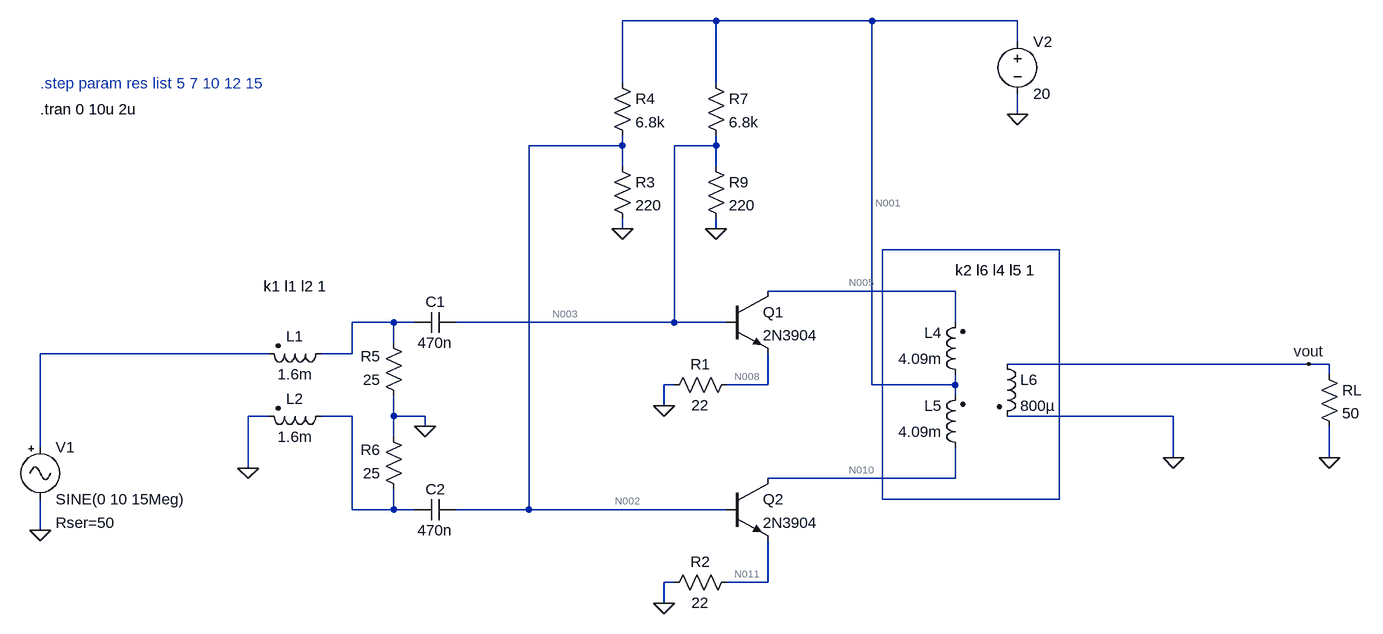
[diagram p0: schematic 0.5W QRP Amplifier class B from Video.asc]
0.5W QRP Amplifier class B from Video.asc, the LTspice schematic file:
Version 4
SHEET 1 1144 680
WIRE 144 -400 0 -400
WIRE 384 -400 144 -400
WIRE 608 -400 384 -400
WIRE 608 -368 608 -400
WIRE 0 -304 0 -400
WIRE 144 -304 144 -400
WIRE 608 -256 608 -288
WIRE 0 -208 0 -224
WIRE 0 -208 -144 -208
WIRE 144 -208 144 -224
WIRE 144 -208 80 -208
WIRE 0 -176 0 -208
WIRE 144 -176 144 -208
WIRE 0 -80 0 -96
WIRE 144 -80 144 -96
WIRE 672 -48 400 -48
WIRE 512 16 224 16
WIRE -352 64 -416 64
WIRE -320 64 -352 64
WIRE 80 64 80 -208
WIRE 80 64 -256 64
WIRE 160 64 80 64
WIRE 512 64 512 16
WIRE -352 96 -352 64
WIRE -544 112 -896 112
WIRE -416 112 -416 64
WIRE -416 112 -464 112
WIRE 1056 128 592 128
WIRE 1088 128 1056 128
WIRE 1088 144 1088 128
WIRE 80 160 64 160
WIRE 224 160 224 112
WIRE 224 160 160 160
WIRE 384 160 384 -400
WIRE 512 160 512 144
WIRE 512 160 384 160
WIRE 512 176 512 160
WIRE 64 192 64 160
WIRE -544 208 -576 208
WIRE -416 208 -464 208
WIRE -352 208 -352 176
WIRE -304 208 -352 208
WIRE 848 208 592 208
WIRE -304 224 -304 208
WIRE -352 240 -352 208
WIRE -896 256 -896 112
WIRE 848 272 848 208
WIRE 1088 272 1088 224
WIRE -576 288 -576 208
WIRE 512 304 512 256
WIRE 512 304 224 304
WIRE 400 336 400 -48
WIRE 672 336 672 -48
WIRE 672 336 400 336
WIRE -416 352 -416 208
WIRE -352 352 -352 320
WIRE -352 352 -416 352
WIRE -320 352 -352 352
WIRE -144 352 -144 -208
WIRE -144 352 -256 352
WIRE 160 352 -144 352
WIRE -896 384 -896 336
WIRE 80 464 64 464
WIRE 224 464 224 400
WIRE 224 464 160 464
WIRE 64 496 64 464
FLAG 64 192 0
FLAG 64 496 0
FLAG -896 384 0
FLAG 0 -80 0
FLAG 848 272 0
FLAG 1088 272 0
FLAG 608 -256 0
FLAG -576 288 0
FLAG -304 224 0
FLAG 144 -80 0
FLAG 1056 128 vout
SYMBOL npn 160 16 R0
SYMATTR InstName Q1
SYMATTR Value 2N3904
SYMBOL npn 160 304 R0
SYMATTR InstName Q2
SYMATTR Value 2N3904
SYMBOL res 176 144 R90
WINDOW 0 0 56 VBottom 2
WINDOW 3 32 56 VTop 2
SYMATTR InstName R1
SYMATTR Value 22
SYMBOL res 176 448 R90
WINDOW 0 0 56 VBottom 2
WINDOW 3 32 56 VTop 2
SYMATTR InstName R2
SYMATTR Value 22
SYMBOL Misc\\signal -896 240 R0
WINDOW 123 0 0 Left 0
WINDOW 39 24 132 Left 2
SYMATTR SpiceLine Rser=50
SYMATTR InstName V1
SYMATTR Value SINE(0 10 15Meg)
SYMBOL res -16 -192 R0
SYMATTR InstName R3
SYMATTR Value 220
SYMBOL res -16 -320 R0
SYMATTR InstName R4
SYMATTR Value 6.8k
SYMBOL ind2 528 160 R180
WINDOW 0 36 80 Left 2
WINDOW 3 36 40 Left 2
SYMATTR InstName L4
SYMATTR Value 4.09m
SYMATTR Type ind
SYMBOL ind2 528 272 R180
WINDOW 0 36 80 Left 2
WINDOW 3 36 40 Left 2
SYMATTR InstName L5
SYMATTR Value 4.09m
SYMATTR Type ind
SYMBOL ind2 576 112 R0
SYMATTR InstName L6
SYMATTR Value 800µ
SYMATTR Type ind
SYMBOL res 1072 128 R0
SYMATTR InstName RL
SYMATTR Value 50
SYMBOL voltage 608 -384 R0
WINDOW 123 0 0 Left 0
WINDOW 39 0 0 Left 0
SYMATTR InstName V2
SYMATTR Value 20
SYMBOL ind2 -448 96 R90
WINDOW 0 5 56 VBottom 2
WINDOW 3 32 56 VTop 2
SYMATTR InstName L1
SYMATTR Value 1.6m
SYMATTR Type ind
SYMBOL ind2 -448 192 R90
WINDOW 0 5 56 VBottom 2
WINDOW 3 32 56 VTop 2
SYMATTR InstName L2
SYMATTR Value 1.6m
SYMATTR Type ind
SYMBOL cap -256 48 R90
WINDOW 0 0 32 VBottom 2
WINDOW 3 32 32 VTop 2
SYMATTR InstName C1
SYMATTR Value 470n
SYMBOL cap -256 336 R90
WINDOW 0 0 32 VBottom 2
WINDOW 3 32 32 VTop 2
SYMATTR InstName C2
SYMATTR Value 470n
SYMBOL res -336 192 R180
WINDOW 0 36 76 Left 2
WINDOW 3 36 40 Left 2
SYMATTR InstName R5
SYMATTR Value 25
SYMBOL res -336 336 R180
WINDOW 0 36 76 Left 2
WINDOW 3 36 40 Left 2
SYMATTR InstName R6
SYMATTR Value 25
SYMBOL res 128 -320 R0
SYMATTR InstName R7
SYMATTR Value 6.8k
SYMBOL res 128 -192 R0
SYMATTR InstName R9
SYMATTR Value 220
TEXT 512 -16 Left 2 !k2 l6 l4 l5 1
TEXT -896 -264 Left 2 !.tran 0 10u 2u
TEXT -896 -304 Left 2 ;.step param res list 5 7 10 12 15
TEXT -552 8 Left 2 !k1 l1 l2 1

The netlist it stands for:
* 0.5W QRP Amplifier class B from Video.asc
Q1 N005 N003 N008 0 2N3904
Q2 N010 N002 N011 0 2N3904
R1 N008 0 22
R2 N011 0 22
V1 N007 0 SINE(0 10 15Meg) Rser=50
R3 N002 0 220
R4 N001 N002 6.8k
L4 N001 N005 4.09m
L5 N010 N001 4.09m
L6 vout 0 800µ
RL vout 0 50
V2 N001 0 20
L1 N006 N007 1.6m
L2 N009 0 1.6m
C1 N003 N006 470n
C2 N002 N009 470n
R5 0 N006 25
R6 N009 0 25
R7 N001 N003 6.8k
R9 N003 0 220
.model NPN NPN
.model PNP PNP
.lib standard.bjt
k2 l6 l4 l5 1
.tran 0 10u 2u
* .step param res list 5 7 10 12 15
k1 l1 l2 1
.backanno
.end

* Results of the author's LTspice run, read from the files saved beside the schematic
* Operating Point, zero values left out:
*   V(n005) = 20 V
*   V(n003) = 626.6 mV
*   V(n008) = 6.725 mV
*   V(n010) = 20 V
*   V(n002) = 626.6 mV
*   V(n011) = 6.725 mV
*   V(n001) = 20 V
*   Ic(Q1) = 304.8 µA
*   Ib(Q1) = 851.7 nA
*   Ie(Q1) = -305.7 µA
*   Ic(Q2) = 304.8 µA
*   Ib(Q2) = 851.7 nA
*   Ie(Q2) = -305.7 µA
*   I(L4) = 304.8 µA
*   I(L5) = -304.8 µA
*   I(R1) = 305.7 µA
*   I(R2) = 305.7 µA
*   I(R3) = 2.848 mA
*   I(R4) = 2.849 mA
*   I(R7) = 2.849 mA
*   I(R9) = 2.848 mA
*   I(V2) = -6.308 mA
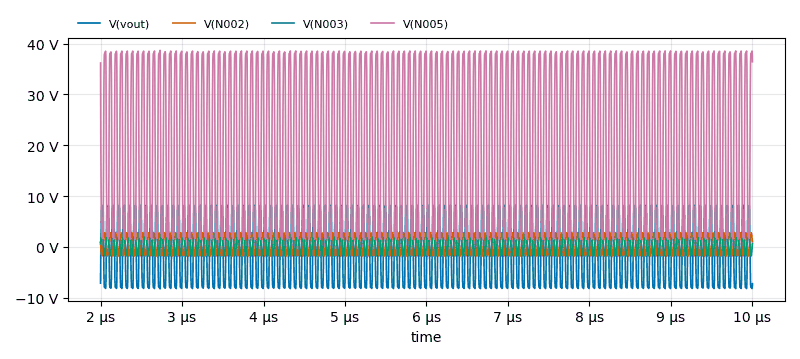
[diagram p1: Transient Analysis of 0.5W QRP Amplifier class B from Video.asc, plotted from the saved traces]
* Transient Analysis, 1 run:
*   V(vout): min -8.251 V, max 8.229 V, average -4.875 mV, rms 6.972 V, last -7.253 V
*   V(N002): min -1.786 V, max 2.795 V, average 622.7 mV, rms 1.742 V, last 1.016 V
*   V(N003): min -1.787 V, max 2.795 V, average 622.1 mV, rms 1.742 V, last 657.4 mV
*   V(N005): min 1.394 V, max 38.66 V, average 20.01 V, rms 25.47 V, last 36.41 V